# Altium schematic sheet jetson_agx_m.2.SchDoc: FOG Board
size B; Date: 07/05/2024; Author: Ethan Rosati; Organization: ORGANIZATION; Address1: ADDRESS 1; Address2: ADDRESS 2; Address3: ADDRESS 3; Address4: ADDRESS 4; Revision: -; SheetNumber: 1; SheetTotal: 1; ENG_APP_DATE: --/--/--; DSN_APP_DATE: --/--/--; CHK_APP_DATE: --/--/--
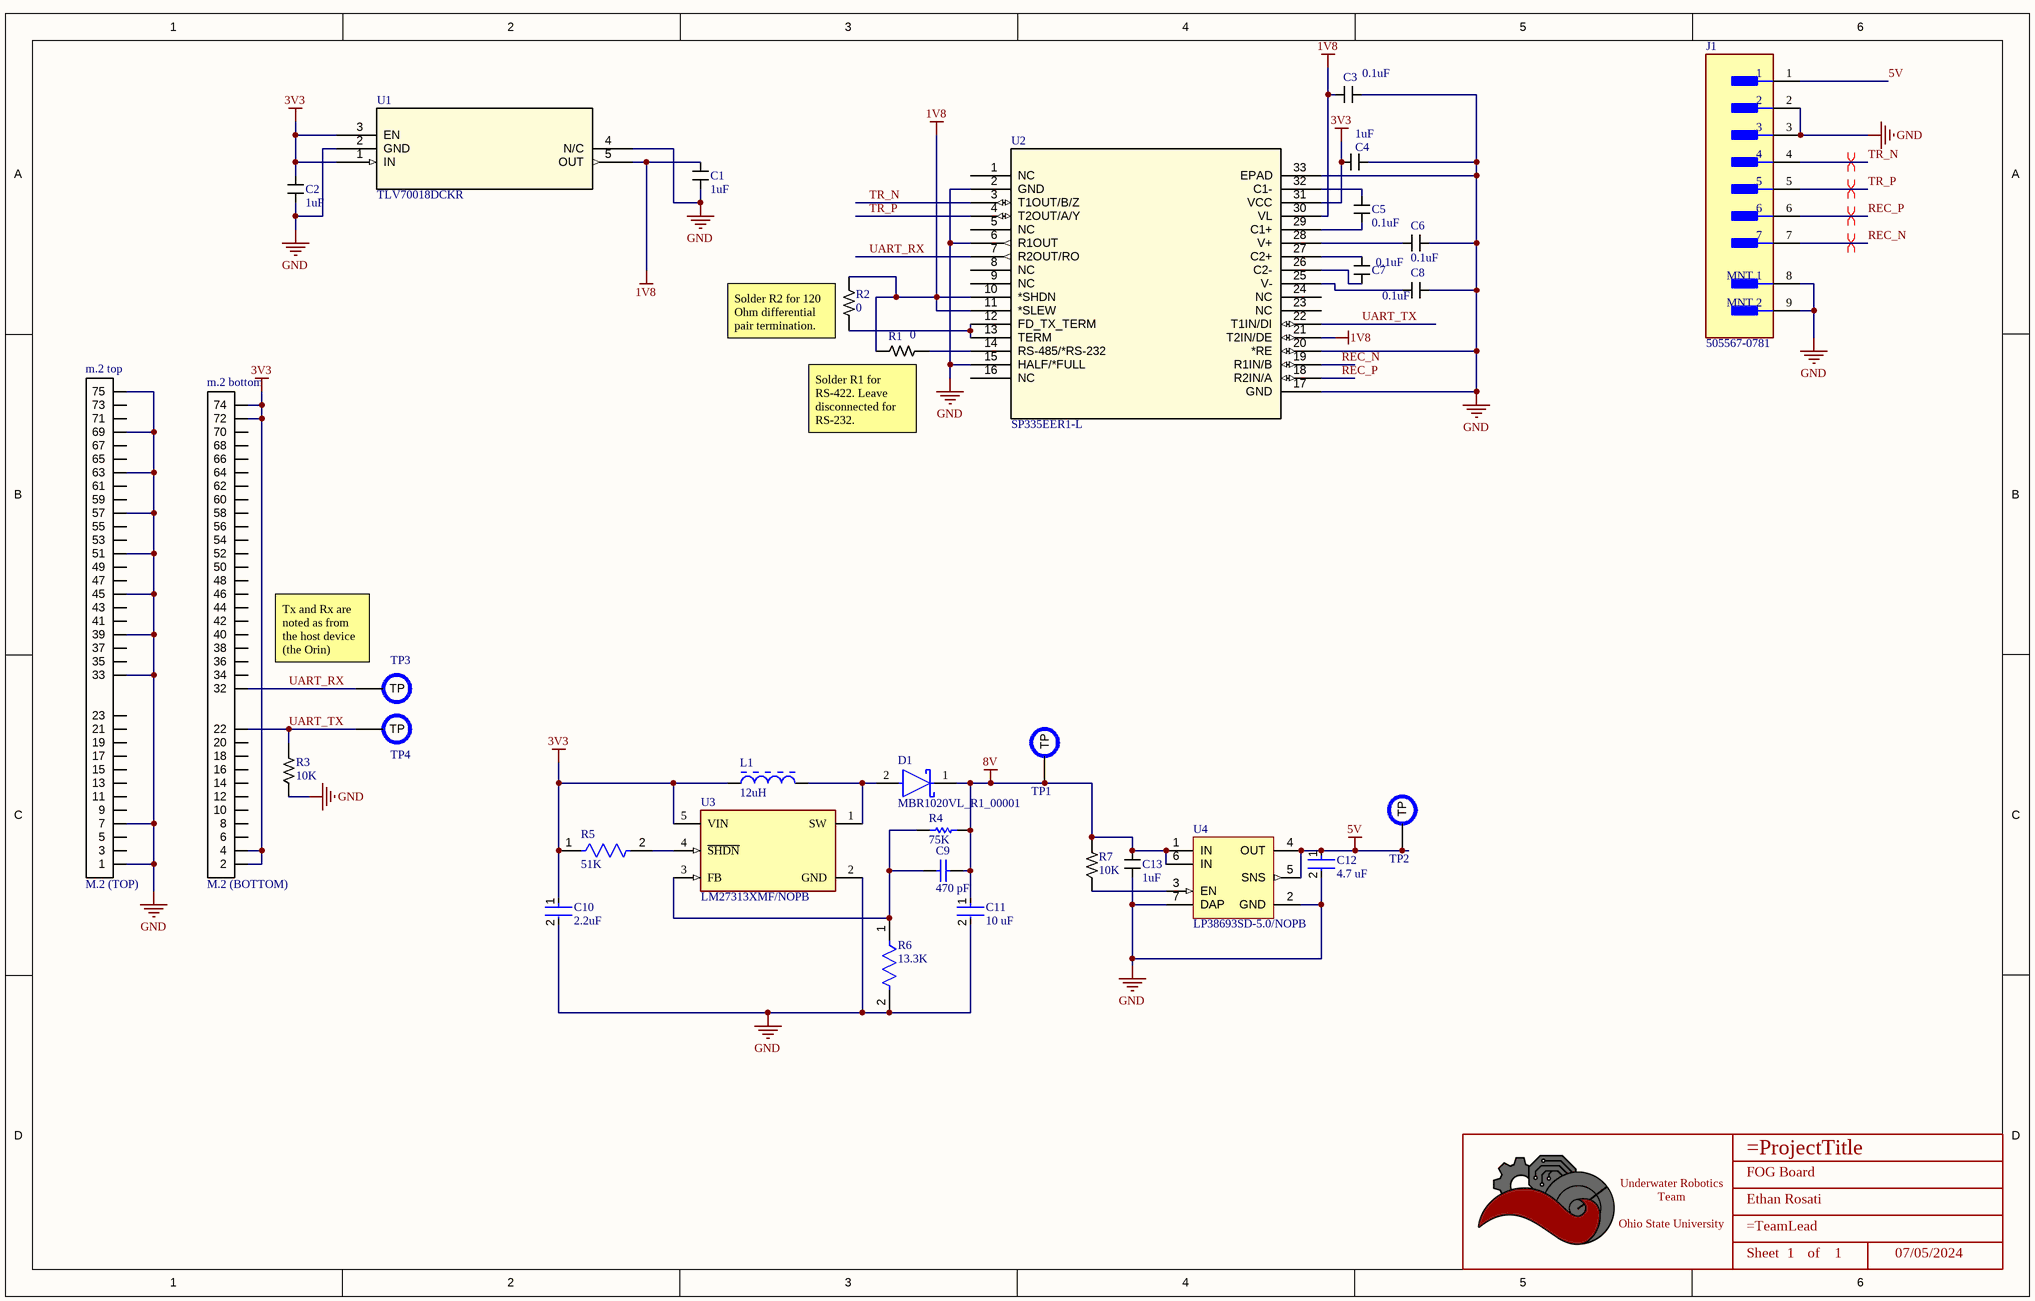
[diagram p0: jetson_agx_m.2.SchDoc]

## Parts
*  Title_Block  [LOGO]  (value not drawn)  (graphical)
C1  value 1uF  [CAPACITOR_0402]  (hidden comment: 1uF Ceramic 16V)
C2  value 1uF  [CAPACITOR_0402]  (hidden comment: 1uF Ceramic 16V)
C3  value 0.1uF  [CAPACITOR_0402]  (hidden comment: 100nF Ceramic 25V)
C4  value 1uF  [CAPACITOR_0402]  (hidden comment: 1uF Ceramic 16V)
C5  value 0.1uF  [CAPACITOR_0402]  (hidden comment: 100nF Ceramic 25V)
C6  value 0.1uF  [CAPACITOR_0402]  (hidden comment: 100nF Ceramic 25V)
C7  value 0.1uF  [CAPACITOR_0402]  (hidden comment: 100nF Ceramic 25V)
C8  value 0.1uF  [CAPACITOR_0402]  (hidden comment: 100nF Ceramic 25V)
C9  470 pF  [CAPC1005X55X25LL05T05]
C10  2.2uF  [FP-GRT155-0_2-IPC_C]
C11  10 uF  [FP-CL07-IPC_C]
C12  4.7 uF  [FP-CL282-IPC_C]
C13  value 1uF  [CAPACITOR_0402]  (hidden comment: 1uF Ceramic 16V)
D1  MBR1020VL_R1_00001  [FP-MBR1020VL_R1_00001-MFG]
J1  505567-0781  [FP-505567-0781-MFG]
L1  12uH  [BOUR-SDR0403-2_V]
m.2_bottom  M.2 (BOTTOM)  [M.2 (bottom)]
m.2_top  M.2 (TOP)  [M.2 (top)]  (no BOM)
R1  Value  (Ohms): 0  [RESISTOR_0402]  (hidden comment: 0 Ohm 1% 1/16W)
R2  Value  (Ohms): 0  [RESISTOR_0402]  (hidden comment: 0 Ohm 1% 1/16W)
R3  Value  (Ohms): 10K  [RESISTOR_0402]  (hidden comment: 10k Ohm 1% 1/16W)
R4  75K  [RESC1005X40X25NL10T10]
R5  51K  [FP-RMCF0402-MFG]
R6  13.3K  [FP-CR0402-MFG]
R7  Value  (Ohms): 10K  [RESISTOR_0402]  (hidden comment: 10k Ohm 1% 1/16W)
TP1  PCB Test Point  [TESTPOINT_1.2MM]  (value not drawn)  (no BOM)
TP2  PCB Test Point  [TESTPOINT_1.2MM]  (value not drawn)  (no BOM)
TP3  PCB Test Point  [TESTPOINT_1.2MM]  (value not drawn)  (no BOM)
TP4  PCB Test Point  [TESTPOINT_1.2MM]  (value not drawn)  (no BOM)
U1  TLV70018DCKR  [SOT-353]
U2  SP335EER1-L  [QFN-32]
U3  LM27313XMF/NOPB  [FP-DBV0005A-IPC_A]
U4  LP38693SD-5.0/NOPB  [NGG0006A_V]

## Nets
1V8: C1.1 C3.1 R1.2 R2.2 U1.5(OUT) U2.10(*SHDN) U2.11(*SLEW) U2.21(T2IN/DE) U2.30(VL)
3V3: C2.1 C4.1 C10.1 L1.1 m.2_bottom.2 m.2_bottom.4 m.2_bottom.72 m.2_bottom.74 R5.1 U1.1(IN) U1.3(EN) U2.31(VCC) U3.5(VIN)
5V: C12.1 J1.1 TP2.TP U4.4(OUT) U4.5(SNS)
8V: C9.2 C11.1 C13.1 D1.1(C) R4.2 R7.1 TP1.TP U4.1(IN) U4.6(IN)
GND: C1.2 C2.2 C3.2 C4.2 C6.2 C8.2 C10.2 C11.2 C12.2 C13.2 J1.2 J1.3 J1.8(MNT_1) J1.9(MNT_2) m.2_top.1 m.2_top.7 m.2_top.33 m.2_top.39 m.2_top.45 m.2_top.51 m.2_top.57 m.2_top.63 m.2_top.69 m.2_top.75 R3.2 R6.2 U1.2(GND) U1.4(N/C) U2.2(GND) U2.6(R1OUT) U2.15(HALF/*FULL) U2.17(GND) U2.20(*RE) U2.33(EPAD) U3.2(GND) U4.2(GND) U4.7(DAP)
REC_N: J1.7 U2.19(R1IN/B)
REC_P: J1.6 U2.18(R2IN/A)
TR_N: J1.4 U2.3(T1OUT/B/Z)
TR_P: J1.5 U2.4(T2OUT/A/Y)
UART_RX: m.2_bottom.32 TP3.TP U2.7(R2OUT/RO)
UART_TX: m.2_bottom.22 R3.1 TP4.TP U2.22(T1IN/DI)
NetC5_1: C5.1 U2.32(C1-)
NetC5_2: C5.2 U2.29(C1+)
NetC6_1: C6.1 U2.28(V+)
NetC7_1: C7.1 U2.27(C2+)
NetC7_2: C7.2 U2.26(C2-)
NetC8_1: C8.1 U2.25(V-)
NetC9_1: C9.1 R4.1 R6.1 U3.3(FB)
NetD1_2: D1.2(A) L1.2 U3.1(SW)
NetR1_1: R1.1 U2.14(RS-485/*RS-232)
NetR2_1: R2.1 U2.12(FD_TX_TERM) U2.13(TERM)
NetR5_2: R5.2 U3.4(~{SHDN})
NetR7_2: R7.2 U4.3(EN)

Not connected (* = marked no-connect by the designer): m.2_bottom 6 8 10 12 14 16 18 20 34 36 38 40 42 44 46 48 50 52 54 56 58 60 62 64 66 68 70; m.2_top 3 5 9 11 13 15 17 19 21 23 35 37 41 43 47 49 53 55 59 61 65 67 71 73; U2 1(NC) 5(NC) 8(NC) 9(NC) 16(NC) 23(NC) 24(NC)

## Layout directives
differential pair: REC_N, REC_P, TR_N, TR_P

## Notes on the sheet
- (near R2) Solder R2 for 120 Ohm differential pair termination.
- (near R1) Solder R1 for RS-422. Leave disconnected for RS-232.
- Tx and Rx are noted as from the host device (the Orin)
- DWG. NO.
- REV.
- SHT.
- THIS DOCUMENT AND THE DATA DISCLOSED HEREIN OR HEREWITH IS THE PROPERTY OF ALTIUM LIMITED AND MAY BE FREELY DISTRIBUTED IN WHOLE. NO RIGHTS ARE RESERVED OR EXPRESS OR IMPLIED WARANTEE GIVEN.
- REVISION
- DESCRIPTION
- DATE
- APPROVED
- ENG:
- APPROVALS
- PROJECT
- DSN:
- CHK:
- REFERENCE DOCUMENTS
- PROJECT REVISION:
- TITLE
- DOCUMENT REVISION:
- DESIGN ITEM:
- BOM:
- FAB DWG:
- PCB DWG:
- ASSY DWG:
- SCALE:
- SIZE
- B
- CAGE CODE
- FILE NAME
- DWG NO.
- SHEET
- OF
- REV
- (in symbol Title_Block) Underwater Robotics Team / Ohio State University; Sheet; of

## Library data of the parts
* = Title_Block: UWRT Schematic Title Block Template / Created June 2021, Dylan Trainor
C1 C2 C4 C13 = CAPACITOR_1uF_0402: Cap 1uF 16V +/-10% / Ceramic 0402; Made By: Robert Pafford; Tolerance: +/- 10%; Voltage: 16V; Supplier 1: Digi-Key; Supplier Part Number 1: 478-0402YD105KAT4ADKR-ND
C3 C5-C8 = CAPACITOR_0.1uF_0402: Cap 100nF 25V +/-10% / Ceramic 0402; Made By: Robert Pafford; Tolerance: +/- 10%; Voltage: 25V; Supplier 1: Digi-Key; Supplier Part Number 1: 478-7868-1-ND
C9 = CMP-2008-02039-1: Part Number: VJ0402Y471KXQCW1BC; Manufacturer: Vitramon
C10 = CMP-06035-008228-1: Multi-Layer Ceramic Capacitor 2.2uF 10V X6S ±10% 0402 Paper T/R; Case Code (Imperial): 0402; Max Operating Temperature: 105°C; Width: 0.02inch; Thickness: 0.022inch; Ratings: AEC-Q200; Mount: Surface Mount; Voltage Rating (DC): 10V; Capacitance: 2.2uF; Voltage Rating: 10V; Dielectric: X6S; Packaging: Tape and Reel; Case/Package: 0402; Case Code (Metric): 1005; Tolerance: 10%; Min Operating Temperature: -55°C; Length: 0.039inch
C11 = CMP-13271-002778-1: Cap Ceramic 10uF 10V X5R ±20% SMD 0402 +85°C Paper T/R; Length: 0.039inch; Mount: Surface Mount; Case Code (Imperial): 0402; Capacitance: 10uF; Max Operating Temperature: 85°C; Voltage Rating: 10V; Min Operating Temperature: -55°C; Case/Package: 0402; Thickness: 0.035inch; Width: 0.02inch; Case Code (Metric): 1005; Packaging: Tape and Reel; Tolerance: 20%
C12 = CMP-13271-000548-1: Cap Ceramic 4.7uF 10V X5R ±20% SMD 0402 +85°C Paper T/R; Capacitance: 4.7uF; Max Operating Temperature: 85°C; Lead Free: Lead Free; Tolerance: 20%; Voltage Rating: 10V; Dielectric: X5R; Width: 0.02inch; Length: 0.039inch; Case/Package: 0402; Min Operating Temperature: -55°C; Packaging: Tape and Reel; Thickness: 0.022inch; Case Code (Imperial): 0402; Package Quantity: 10000; Case Code (Metric): 1005; Mount: Surface Mount
D1 = CMP-34900-000005-1: DIODE SCHOTTKY 20V 1A SOD123FL; RoHS Compliant: Yes
J1 = CMP-00257-87166176-1: 505567-0781 Conn Shrouded Header (4 Sides) HDR 7 POS 1.25mm Solder RA Side Entry SMD Micro-Lock PLUS T/R; Manufacturer Lifecycle Status: ACTIVE; Plating: Gold; Number of Circuits: 7; Number of Rows: 1; NexarPartId: 87166176; Contact Plating: Gold; Lifecycle Status: Production; Orientation: Right Angle; Country of Origin: MY; RoHS: Compliant
L1 = CMP-0904-00022-1: SDR0403 Series Power Inductor, 12 uH +/- 20 %, 0.21 Ohm, -40 to 125 degC, 2-Pin SMD, RoHS, Tape and Reel; PartNumber: SDR0403-120ML; Manufacturer: Bourns; I rms (A): 1.05 Max.; Q: 28; SRF (MHz): 30 Min.; RDC (Ohm): 0.21 Max.; Tolerance (%): +/- 20; Test Frequency (MHz): 2.52; Inductance (uH): 12; I sat (A): 1.6 Typ.; ComponentLink1URL: http://www.bourns.com/; Temperature Range: -40 to 125 degC; ComponentLink2URL: http://www.bourns.com/data/global/pdfs/sdr0403.pdf; Mounting Technology: Surface Mount; Packing: Tape and Reel; PackageDescription: 3-Pin SMD, Dia 4.5 mm, Height 3.5 mm; PackageReference: SDR0403-2; ComponentLink1Description: Manufacturer URL; DatasheetVersion: Feb-12; RoHS: TRUE; ComponentLink2Description: Datasheet
m.2_top = M.2 (TOP): M.2 E-Key top fingers; Created By: Ethan Rosati; Reviewed By: *
R1 R2 = RESISTOR_0_0402: RES 0 OHM 1% 1/16W 0402; Tolerance: +/- 1%; Made By: Robert Pafford; Wattage: 1/16W; Supplier 1: Digikey; Supplier Part Number 1: 13-AC0402FR-070RLCT-ND
R3 R7 = RESISTOR_10K_0402: RES 10k OHM 1% 1/16W 0402; Tolerance: +/- 1%; Made By: Robert Pafford; Wattage: 1/16W; Supplier: Digikey; Digikey Part Numer: CR0603-JW-104ELFTR-ND; Supplier 1: Digi-Key; Supplier Part Number 1: YAG3436CT-ND
R4 = CMP-2002-05825-1: Part Number: ERA-2AEB753X; Manufacturer: Panasonic
R5 = CMP-26527-005598-1: 51kΩ ±5% 0.063W 0402 Thick Film Chip Resistor AEC-Q200 compliant; Resistance: 51kR; Power Rating: 63mW; Temperature Coefficient: 100ppm/°C; Radiation Hardening: No; Number of Terminations: 2; Case Code (Imperial): 0402; Width: 0.02inch; Length: 0.039inch; Mount: Surface Mount; Case/Package: 0402; Series: RMCF; RoHS Compliant: Yes; Size Code: 0402; Contact Plating: Tin; Max Power Dissipation: 63mW; Min Operating Temperature: -55°C; Lead Free: Lead Free; Tolerance: 5%; Height: 0.016inch; Case Code (Metric): 1005; Max Operating Temperature: 155°C; Packaging: Tape and Reel; Features: Automotive AEC-Q200; Resistor Type: Thick Film
R6 = CMP-1011-00636-3: Thick Film Chip Resistors 0402 13.3kΩ 0.0625W 1% 100ppm/°C; Power Rating: 62.5mW; Resistance: 13.3kR; Voltage Rating: 50V; Max Power Dissipation: 63mW; Number of Terminations: 2; Case Code (Metric): 1005; Case Code (Imperial): 0402; Height: 0.016inch; Length: 0.039inch; Min Operating Temperature: -55°C; Mount: Surface Mount; Packaging: Tape and Reel; Composition: Thick Film; Width: 0.02inch; Military Standard: Not; Package Quantity: 10000; Thickness: 356um; Radiation Hardening: No; Tolerance: 1%; Termination: SMD/SMT; Contact Plating: Tin; Case/Package: 0402; Temperature Coefficient: 100ppm/°C; Max Operating Temperature: 125°C; Depth: 0.5mm
TP1-TP4 = TESTPOINT: Made By: Robert Pafford
U1 = TLV70018DCKR: Fixed Positive LDO Regulator, 1.8V, PMOS, PDSO5; Made By: Ethan Rosati; Max Voltage: 5.5 V; Min Voltage: 2 V; Output Current: 200 mA; Reviewed By: *; Output Voltage: 1.8 V; Supplier 1: Mouser; Supplier Part Number 1: 595-TLV70018DCKR
U2 = SP335EER1-L: 1/1, 2/2 Transceiver Full RS232, RS422, RS485 32-QFN (5x5); Supply Voltage: 3V - 5.5V; Created By: Ethan Rosati; Reviewed By: *; Supplier 1: Digikey; Supplier Part Number 1: 1016-1969-ND
U3 = CMP-0069-01219-5: IC REG BOOST ADJ 800MA SOT23-5; Min Output Voltage: 4V; Min Input Voltage: 2.7V; Quiescent Current: 2.1mA; Max Input Voltage: 14V; Output Power: 2.5W; Number of Outputs: 1; Output Configuration: Positive; Output Type: Adjustable; Max Output Voltage: 28V; Synchronous Rectifier: No; Switching Frequency: 1.6MHz; Efficiency: 80%; Height: 1.02mm; Number of Pins: 5; Package Quantity: 1; Output Current: 800mA; Min Operating Temperature: -40°C; RoHS Compliant: Yes; Contact Plating: Tin; Max Operating Temperature: 125°C; Series: LM27313; Mount: Surface Mount; Length: 2.92mm; Case/Package: SOT-23-5; Width: 1.6mm; Output Voltage: 28V; Topology: Boost; Lead Free: Lead Free; Max Output Current: 800mA; REACH SVHC: No SVHC; Packaging: Tape and Reel; Radiation Hardening: No
U4 = CMP-0062-01512-4: 500mA Low Dropout CMOS Linear Regulators Stable with Ceramic Output Capacitors, 6-pin LLP, Pb-Free, 1000 Reel; Manufacturer: Texas Instruments; High-Reliability: Y; PackageTopMarking: ZXYTT*L131B; CompType: LDO IC; RoHS: Y; PackageReference: NGG0006A; PartNumber: LP38693SD-5.0/NOPB; ComponentLink1Description: Datasheet URL; ComponentLink1URL: http://www.ti.com/general/docs/lit/getliterature.tsp?genericPartNumber=LP38693&fileType=pdf; PowerWise: Y; PackageDescription: LLP, Plastic, Dual, 3 x 3 x 0.8mm Body, 6 Lead, 0.95mm Pitch, No Pullback; PinCount: 6
m.2_bottom = M.2 (BOTTOM): Created By: Ethan Rosati; Reviewed By: *